# EAGLE design led_driver (EAGLE 7.2.0)
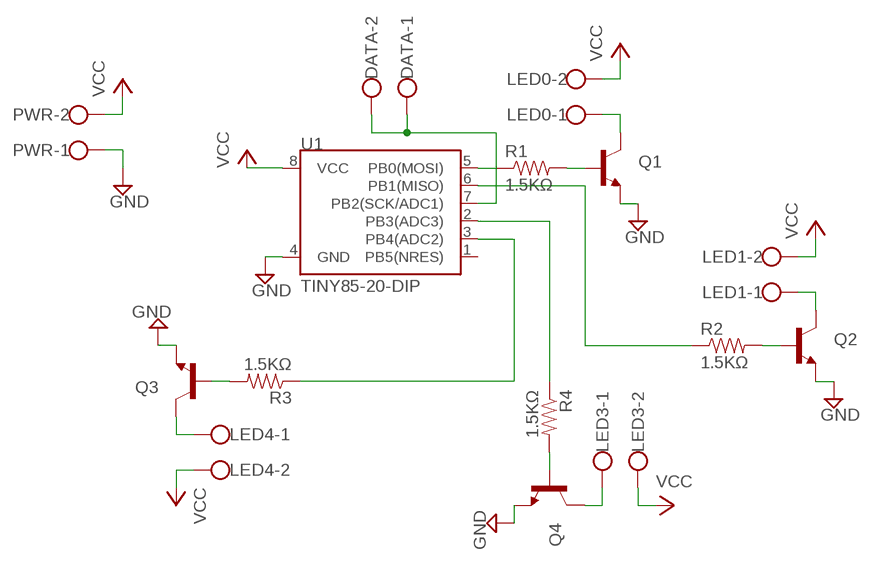
[diagram p0: schematic, sheet 1]

## Parts
DATA  W237-102  [W237-102]
LED0  W237-102  [W237-102]
LED1  W237-102  [W237-102]
LED3  W237-102  [W237-102]
LED4  W237-102  [W237-102]
PWR  W237-102  [W237-102]
Q1  TRANSISTOR_NPNBC547  [TO-92-AMMO]
Q2  TRANSISTOR_NPNBC547  [TO-92-AMMO]
Q3  TRANSISTOR_NPNBC547  [TO-92-AMMO]
Q4  TRANSISTOR_NPNBC547  [TO-92-AMMO]
R1  1.5ΚΩ  RESISTORAXIAL-0.3  [AXIAL-0.3]
R2  1.5ΚΩ  RESISTORAXIAL-0.3  [AXIAL-0.3]
R3  1.5KΩ  RESISTORAXIAL-0.3  [AXIAL-0.3]
R4  1.5ΚΩ  RESISTORAXIAL-0.3  [AXIAL-0.3]
U1  TINY85-20-DIP  ATTINY45TINY85-20-DIP  [DIP08]

## Nets
DATA-IN: DATA.1 DATA.2 U1.7(PB2(SCK/ADC1))
GND: PWR.1 Q1.3(E) Q2.3(E) Q3.3(E) Q4.3(E) U1.4(GND)
LED0: R1.P$1 U1.5(PB0(MOSI))
LED0-GND: LED0.1 Q1.1(C)
LED1: R2.P$1 U1.6(PB1(MISO))
LED1-GND: LED1.1 Q2.1(C)
LED3: R4.P$1 U1.2(PB3(ADC3))
LED3-GND: LED3.1 Q4.1(C)
LED4: R3.P$1 U1.3(PB4(ADC2))
LED4-GND: LED4.1 Q3.1(C)
N$3: Q1.2(B) R1.P$2
N$6: Q2.2(B) R2.P$2
N$10: Q3.2(B) R3.P$2
N$12: Q4.2(B) R4.P$2
VCC: LED0.2 LED1.2 LED3.2 LED4.2 PWR.2 U1.8(VCC)
Unconnected: U1.1(PB5(NRES))

## Library data of the parts
DATA LED0 LED1 LED3 LED4 PWR = con-wago-500:W237-102: WAGO SCREW CLAMP; MPN: 237-102; OC_FARNELL: unknown; OC_NEWARK: 70K9898
Q1-Q4 = SparkFun-DiscreteSemi:TRANSISTOR_NPN: Generic NPN BJT MMBT2222A - TRANS-08049 (SOT-23, 1A 40V) MPSA42 - TRANS-09116 (SOT-23, 500mA 300V) MMBT5088LT1G - TRANS-11160 (SOT-23, 50 mA 30V) BC547 - COM-08928 <http://www.sparkfun.com/products/8928> (TO-92 45V 100mA) (1.Collector 2.Base 3.Emitter) 2N3904 - COM-00521 <http://www.sparkfun.com/products/521> (TO-92 40V 200mA) (1.Emitter 2.Base 3.Collector) P2N2222A - COM-12852 <http://www.sparkfun.com/products/12852> (TO-92 40V 600mA) (1.Collector 2.Base 3.Emitter)
R1-R4 = SparkFun-Passives:RESISTOR: Resistor Basic schematic elements and footprints for 0603, 1206, and PTH resistors.
U1 = SparkFun-DigitalIC:ATTINY45: Atmel 8-pin 2/4/8kB flash uC; PROD_ID: IC-09445

## Board
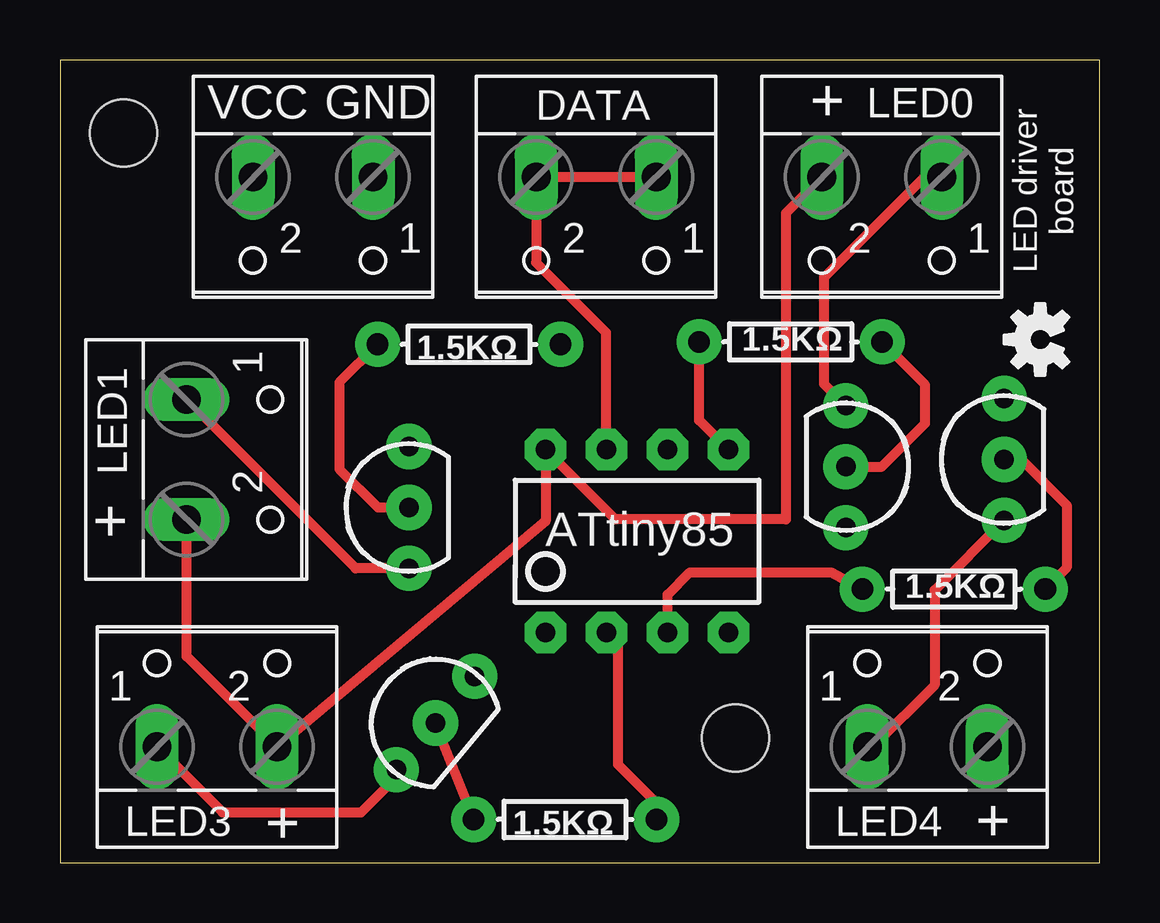
[diagram p1: board, top side]
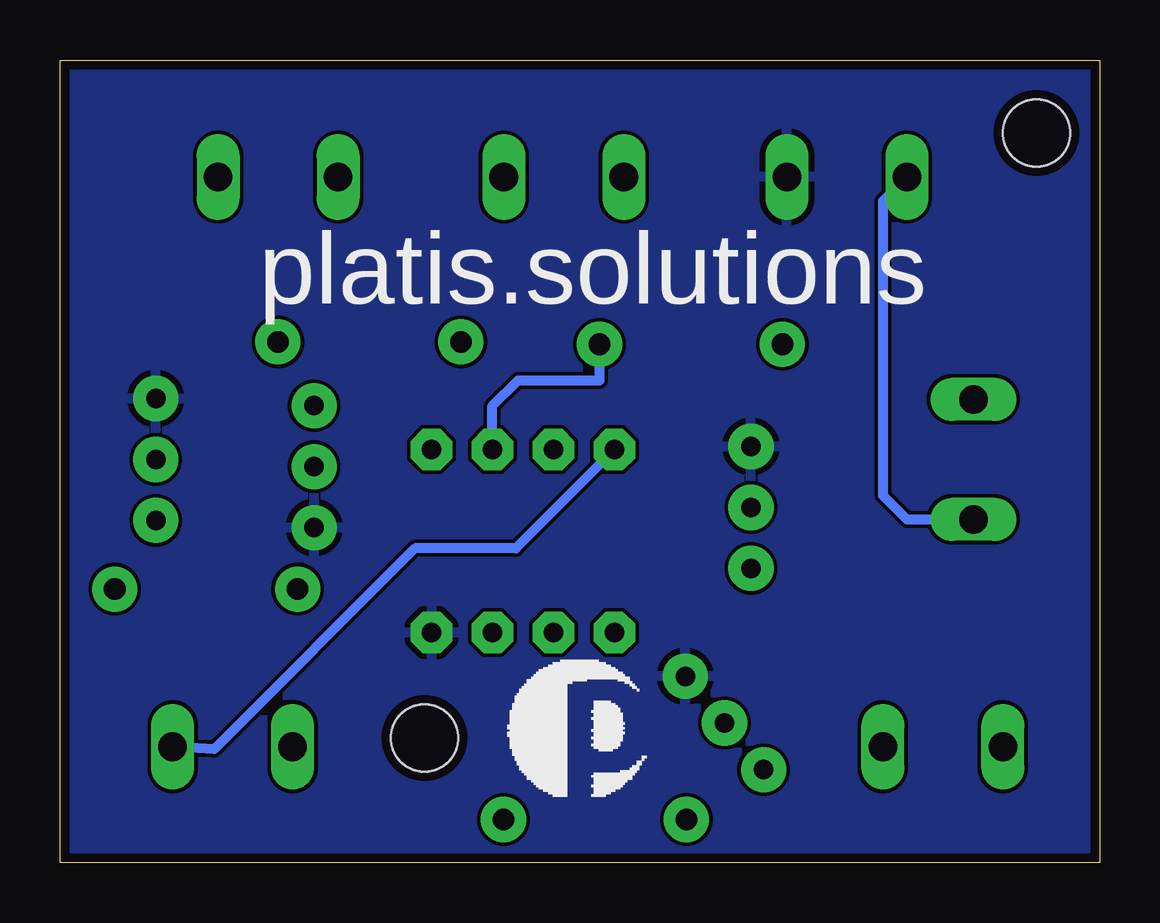
[diagram p2: board, bottom side, seen from below]

Size 43.33 x 33.44 mm. Coordinates in mm from the lower left corner, seen from the top.
Outline: 0,0 43.33,0 43.33,33.44 0,33.44 0,0
Copper layers (1*16): Top 0.0356mm / dielectric 1.5011mm / Bottom 0.0356mm
Design rules "LaenPCBOrder": minimum track width 6mil, minimum drill 13mil, track to track 6mil, track to pad 6mil, pad to pad 6mil, via to via 6mil, smd to smd 6mil, copper to edge 15mil, drill to drill 6mil, minimum pad ring 7mil, minimum via ring 7mil, stop-mask expansion 3mil, vias tented up to drill 0mil, thermal gap 10mil
Holes 2.8 mm at 2.64,30.39 28.14,5.19

### Footprints (pad centres in the part's own frame; a part is rotated, then mirrored left to right if it is on the bottom)
W237-102 = drill 1.194 long: 1 -2.5,-1.27; 2 2.5,-1.27
TO-92-AMMO = drill 0.813 pad 1.88: 1 -2.54,0; 2 0,0; 3 2.54,0
AXIAL-0.3 = drill 0.9 pad 1.88: P$1 -3.81,0; P$2 3.81,0
DIP08 = drill 0.813 pad 1.727 octagon: 1 -3.81,-3.81; 2 -1.27,-3.81; 3 1.27,-3.81; 4 3.81,-3.81; 5 3.81,3.81; 6 1.27,3.81; 7 -1.27,3.81; 8 -3.81,3.81

### Placement (x,y rotation side)
DATA  22.34,27.29 180 top
LED0  34.24,27.29 180 top
LED1  6.54,16.79 270 top
LED3  6.54,6.09 0 top
LED4  36.14,6.09 0 top
PWR  10.54,27.29 180 top
Q1  32.74,16.49 270 top
Q2  14.54,14.79 90 top
Q3  39.34,16.79 90 top
Q4  15.64,5.81 50 top
R1  30.44,21.69 0 top
R2  17.04,21.59 180 top
R3  37.24,11.39 0 top
R4  21.04,1.79 180 top
U1  24.04,13.39 0 top
U$1  [OSHW-LOGO-S]  40.84,21.79 90 top

### Tracks (layer width: path | path; a pad name or v marks a point on that pad's centre or on a via)
DATA-IN
  Top 0.406: DATA.1 DATA.2 19.84,24.99 22.74,22.09 22.74,17.23 U1.7
GND
  pour Bottom: 0.24,33.09 43.04,33.09 43.04,0.29 0.24,0.29
LED0
  Top 0.406: U1.5 26.63,18.42 R1.P$1
LED0-GND
  Top 0.406: Q1.1 31.84,19.93 31.84,24.39 36.01,28.56 LED0.1
LED1
  Bottom 0.406: U1.6 25.31,19.02 24.24,20.09 20.85,20.09 R2.P$1
LED1-GND
  Top 0.406: Q2.1 12.31,12.25 LED1.1
LED3
  Top 0.406: U1.2 23.24,9.11 23.24,4.09 24.85,2.48 R4.P$1
LED3-GND
  Top 0.406: LED3.1 6.77,2.09 12.54,2.09 14.01,3.56 Q4.1
LED4
  Top 0.406: U1.3 25.31,11.16 26.24,12.09 32.13,12.09 R3.P$1
LED4-GND
  Top 0.406: Q3.1 36.44,11.35 36.44,7.39 33.87,4.82 LED4.1
N$3
  Top 0.406: Q1.2 34.24,16.49 36.04,18.29 36.04,19.9 R1.P$2
N$6
  Top 0.406: R2.P$2 11.64,20 11.64,16.39 13.24,14.79 Q2.2
N$10
  Top 0.406: Q3.2 40.04,16.79 41.94,14.89 41.94,12.28 R3.P$2
N$12
  Top 0.406: R4.P$2 Q4.2
VCC
  Top 0.406: LED0.2 30.24,27.06 30.24,14.29 23.14,14.29 U1.8 20.23,14.21 LED3.2 5.27,8.59 LED1.2
  Bottom 0.406: PWR.2 9.04,27.56 9.04,15.29 8.04,14.29 LED1.2 | U1.8 24.34,13.09 28.54,13.09 36.91,4.72 LED4.2

### Text on the board
tPlace: VCC | GND | + | LED driver / board | + | ATtiny85 | + | +
bPlace: platis.solutions